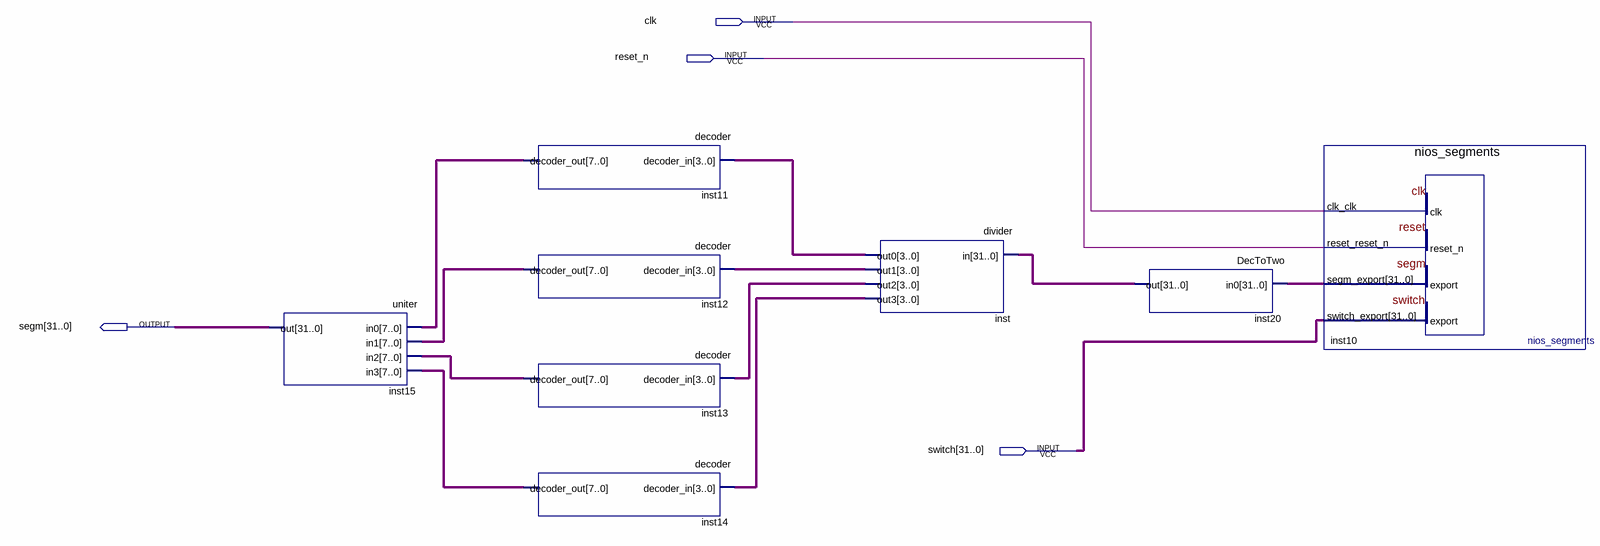
[diagram p0: schematic sheet]
// Quartus schematic NiosSegments_top.bdf as structural Verilog: 8 symbols, 4 pins
module NiosSegments_top (
  input  clk,
  input  reset_n,
  input  [31:0] switch,
  output [31:0] segm
);

  wire [3:0] inst_out0, inst_out1, inst_out2, inst_out3;
  wire [7:0] inst11_decoder_out, inst12_decoder_out, inst13_decoder_out, inst14_decoder_out;
  wire [31:0] inst10_segm_export, inst20_out;

  uniter inst15 (
    .in0(inst11_decoder_out), .in1(inst12_decoder_out), .in2(inst13_decoder_out), .in3(inst14_decoder_out),
    .out(segm));
  decoder inst11 (.decoder_in(inst_out0), .decoder_out(inst11_decoder_out));
  decoder inst12 (.decoder_in(inst_out1), .decoder_out(inst12_decoder_out));
  decoder inst13 (.decoder_in(inst_out2), .decoder_out(inst13_decoder_out));
  decoder inst14 (.decoder_in(inst_out3), .decoder_out(inst14_decoder_out));
  divider inst (.in(inst20_out), .out0(inst_out0), .out1(inst_out1), .out2(inst_out2), .out3(inst_out3));
  DecToTwo inst20 (.in0(inst10_segm_export), .out(inst20_out));
  nios_segments inst10 (
    .clk_clk(clk), .reset_reset_n(reset_n), .switch_export(switch), .segm_export(inst10_segm_export));
endmodule
